# EAGLE design pwdproto (EAGLE 5.10)
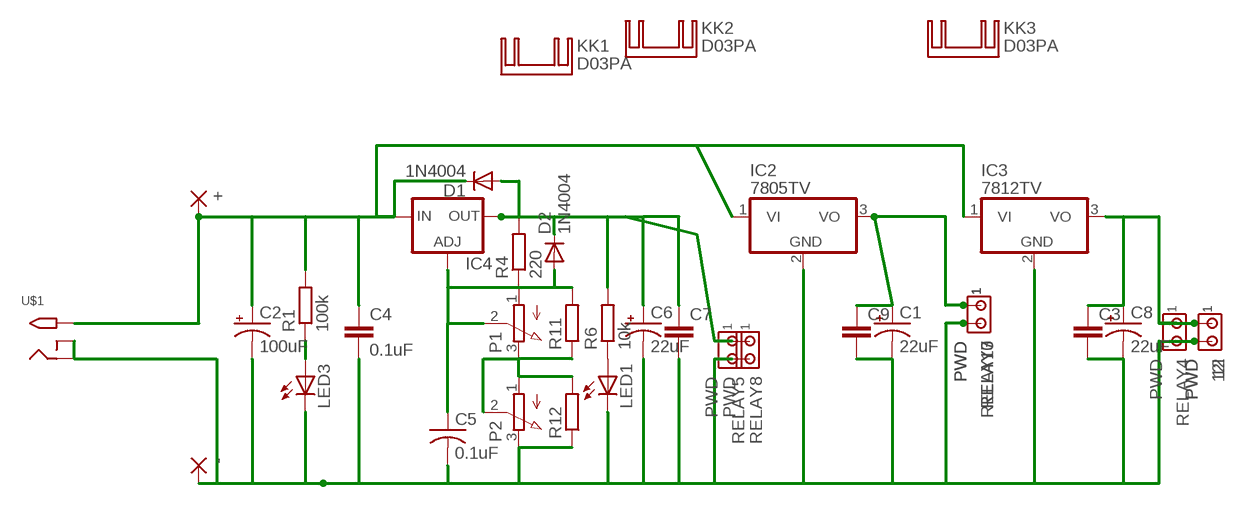
[diagram p0: schematic, sheet 1]

## Parts
12  PWD  MTA02-100  [10X02MTA]
12I  PWD  MTA02-100  [10X02MTA]
+  2,54/0,8  [2,54/0,8]
-  2,54/0,8  [2,54/0,8]
C1  22uF  CPOL-USE5-6  [E5-6]
C2  100uF  CPOL-USE5-6  [E5-6]
C3  C5/2.5  [C5B2.5]
C4  0.1uF  C5/2.5  [C5B2.5]
C5  0.1uF  C-US075-032X103  [C075-032X103]
C6  22uF  CPOL-USE5-6  [E5-6]
C7  C5/2.5  [C5B2.5]
C8  22uF  CPOL-USE5-6  [E5-6]
C9  C5/2.5  [C5B2.5]
D1  1N4004  [DO41-10]
D2  1N4004  [DO41-10]
IC2  7805TV  [TO220V]
IC3  7812TV  [TO220V]
IC4  LM317TS  [317TS]
KK1  D03PA  [D03PA]
KK2  D03PA  [D03PA]
KK3  D03PA  [D03PA]
LED1  LED3MM  [LED3MM]
LED3  LED3MM  [LED3MM]
P1  3RP/1610N  [3RP/1610N]
P2  3RP/1610N  [3RP/1610N]
R1  100k  R-EU_0207/7  [0207/7]
R4  220  R-EU_0207/7  [0207/7]
R6  10k  R-EU_0207/7  [0207/7]
R11  R-EU_0207/7  [0207/7]
R12  R-EU_0207/7  [0207/7]
RELAY3  PWD  MTA02-100  [10X02MTA]
RELAY4  PWD  MTA02-100  [10X02MTA]
RELAY5  PWD  MTA02-100  [10X02MTA]
RELAY7  PWD  MTA02-100  [10X02MTA]
RELAY8  PWD  MTA02-100  [10X02MTA]
RELAY10  PWD  MTA02-100  [10X02MTA]
U$1  2.1MMJACKTHM  [PJ-102A]

## Nets
GND: 12.2 12I.2 -.1(P) C1.- C2.- C3.2 C4.2 C5.2 C6.- C7.2 C8.- C9.2 IC2.2(GND) IC3.2(GND) LED1.K(C) LED3.K(C) P2.3(E) R12.1 RELAY3.2 RELAY4.2 RELAY5.2 RELAY7.2 RELAY8.2 RELAY10.2 U$1.RING U$1.RING_SW
N$2: LED1.A R6.1
N$6: +.1(P) C2.+ C4.1 D1.C IC2.1(VI) IC3.1(VI) IC4.3(IN) R1.2 U$1.TIP
N$12: LED3.A R1.1
N$14: P1.3(E) P2.1(A) P2.2(S) R11.1 R12.2
N$17: 12.1 12I.1 C3.1 C8.+ IC3.3(VO) RELAY4.1
N$18: C1.+ C9.1 IC2.3(VO) RELAY3.1 RELAY7.1 RELAY10.1
N$19: C5.1 D2.A IC4.1(ADJ) P1.1(A) P1.2(S) R4.1 R11.2
N$20: C6.+ C7.1 D1.A D2.C IC4.2(OUT) R4.2 R6.2 RELAY5.1 RELAY8.1

## Library data of the parts
12 12I RELAY3-RELAY5 RELAY7 RELAY8 RELAY10 = con-amp:MTA02-100: AMP connector
+ - = wirepad:2,54/0,8: THROUGH-HOLE PAD
C1 C2 C6 C8 = rcl:CPOL-US: POLARIZED CAPACITOR, American symbol
C3 C4 C7 C9 = capacitor-wima:C: CAPACITOR naming: grid - package width
C5 = adafruit:C-US: CAPACITOR, American symbol
D1 D2 = adafruit:1N4004: DIODE General purpose 1N400x type rectifier (With bigger pads) http://www.ladyada.net/library/pcb/eaglelibrary.html
IC2 IC3 = linear:78*: Positive VOLTAGE REGULATOR Source: http://cache.national.com/ds/LM/LM78L05.pdf http://www.fairchildsemi.com/ds/LM/LM7805.pdf
IC4 = v-reg:LM317TS: VOLTAGE REGULATOR
KK1-KK3 = heatsink:D03PA: HEATSINK distributor Schukat
LED1 LED3 = adafruit:LED: LED OSRAM: - CHIPLED LG R971, LG N971, LY N971, LG Q971, LY Q971, LO R971, LY R971 LH N974, LH R974 LS Q976, LO Q976, LY Q976 LO Q996 - Hyper CHIPLED LW Q18S LB Q993, LB Q99A, LB R99A - SideLED LS A670, LO A670, LY A670, LG A670, LP A670 LB A673, LV A673, LT A673, LW A673 LH A674 LY A675 LS A676, LA A676, LO A676, LY A676, LW A676 LS A679, LY A679, LG A679 - Hyper Micro SIDELED® LS Y876, LA Y876, LO Y876, LY Y876 LT Y87S - SmartLED LW L88C, LW L88S LB L89C, LB L89S, LG L890 LS L89K, LO L89K, LY L89K LS L896, LA L896, LO L896, LY L896 - TOPLED LS T670, LO T670, LY T670, LG T670, LP T670 LSG T670, LSP T670, LSY T670, LOP T670, LYG T670 LG T671, LOG T671, LSG T671 LB T673, LV T673, LT T673, LW T673 LH T674 LS T676, LA T676, LO T676, LY T676, LB T676, LH T676, LSB T676, LW T676 LB T67C, LV T67C, LT T67C, LS T67K, LO T67K, LY T67K, LW E67C LS E67B, LA E67B, LO E67B, LY E67B, LB E67C, LV E67C, LT E67C LW T67C LS T679, LY T679, LG T679 LS T770, LO T770, LY T770, LG T770, LP T770 LB T773, LV T773, LT T773, LW T773 LH T774 LS E675, LA E675, LY E675, LS T675 LS T776, LA T776, LO T776, LY T776, LB T776 LHGB T686 LT T68C, LB T68C - Hyper Mini TOPLED® LB M676 - Mini TOPLED Santana® LG M470 LS M47K, LO M47K, LY M47K Source: http://www.osram.convergy.de/
P1 P2 = pot:3RP/1610N: 16mm Potentiometer one level Source: http://www.alphapotentiometers.net/html/16mm_pot_2.html
R1 R4 R6 R11 R12 = resistor:R-EU_: RESISTOR, European symbol
U$1 = adafruit:2.1MMJACK: 2.1mm x 5.5mm THM DC jack with internal switch. Digikey part #PJ-102A, 4UCON part #05537 2.1mm x 5.5mm SMT DC jack with internal switch. Digikey part #PJ-002A-SMT, 4UCON part #03267 By microbuilder.eu & adafruit.com

## Board
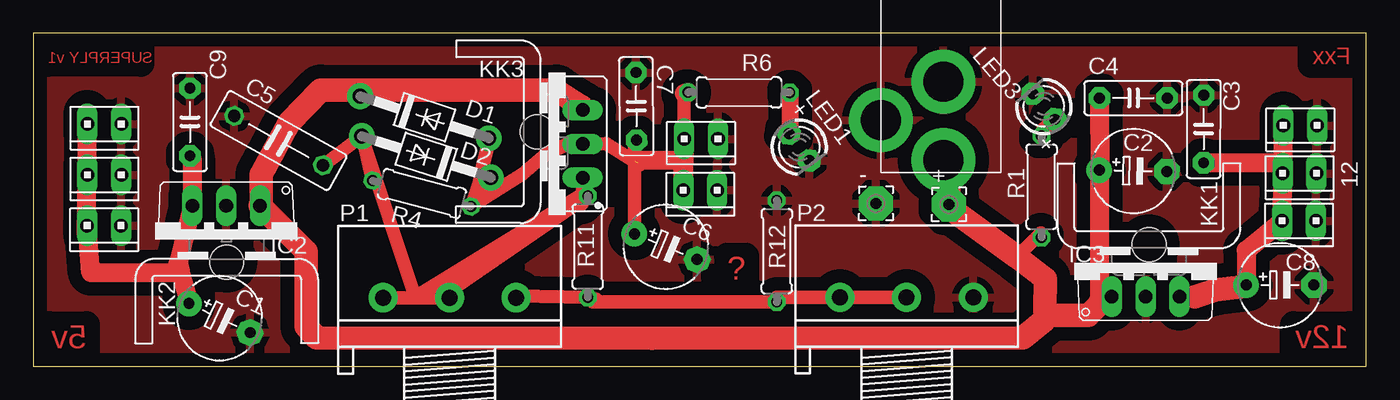
[diagram p1: board, top side]

Size 100 x 25 mm. Coordinates in mm from the lower left corner, seen from the top.
Outline: 100,0 100,25 0,25 0,0 100,0
Copper layers (1*16): Top 0.035mm / dielectric 1.5mm / Bottom 0.035mm
Design rules "default *": minimum track width 40mil, minimum drill 24mil, track to track 20mil, track to pad 35mil, pad to pad 20mil, via to via 20mil, smd to smd 8mil, copper to edge 40mil, drill to drill 8mil, minimum pad ring 10mil, minimum via ring 10mil, stop-mask expansion 8mil, vias tented up to drill 0mil, thermal gap 20mil

### Footprints (pad centres in the part's own frame; a part is rotated, then mirrored left to right if it is on the bottom)
10X02MTA = drill 1.016 long: 1 1.27,0; 2 -1.27,0
2,54/0,8 = drill 0.813 pad 2.54 octagon: 1 0,0
E5-6 = drill 0.813 pad 1.905 round: + -2.54,0 | drill 0.813 pad 1.905 octagon: - 2.54,0
C5B2.5 = drill 0.813 pad 1.6 octagon: 1 -2.54,0; 2 2.54,0
C075-032X103 = drill 0.914 octagon: 1 -3.81,0; 2 3.81,0
DO41-10 = drill 1.118 pad 1.93 round: A 5.08,0; C -5.08,0
TO220V = drill 1.016 long: 1 -2.54,-2.54; 2 0,-2.54; 3 2.54,-2.54
317TS = drill 1.016 long: 1 -2.54,-2.54; 2 0,-2.54; 3 2.54,-2.54
D03PA = hole 2.54: 0,-1.016
LED3MM = drill 0.813 pad 1.676 octagon: A -1.27,0; K 1.27,0
3RP/1610N = drill 1.2 pad 2.184 round: 1 -5,0; 2 0,0; 3 5,0
0207/7 = drill 0.813 octagon: 1 -3.81,0; 2 3.81,0
PJ-102A = drill 3 pad 4.8 round: RING 0.1,-3.39; RING_SW -4.6,-6.29; TIP 0.1,-9.29

### Placement (x,y rotation side)
12  95,14.48 180 top
12I  95.05,18.08 180 top
+  68.69,12.14 0 top
-  63.22,12.23 0 top
C1  13.97,3.62 334.6 top
C2  82.51,14.67 358.9 top
C3  87.81,17.81 89.9 top
C4  82.53,20.14 0 top
C5  18.4,16.94 150.9 top
C6  47.45,8.98 337.7 top
C7  45.24,19.52 90.5 top
C8  93.54,6.1 0 top
C9  11.75,18.34 90 top
D1  29.35,18.7 341.9 top
D2  29.48,15.72 162.2 top
IC2  14.47,9.52 180 top
IC3  83.45,7.76 0 top
IC4  38.67,16.7 90 top
KK1  83.71,10.14 0 top
KK2  14.5,6.8 180 top
KK3  36.8,17.6 90 top
LED1  57.46,16.46 306.8 top
LED3  75.82,19.5 131 top
P1  31.23,5.15 0 top
P2  65.52,5.16 0 top
R1  75.64,13.48 270 top
R4  29.15,12.97 345.2 top
R6  52.94,20.56 179.8 top
R11  41.6,8.98 90 top
R12  55.78,8.64 270 top
RELAY3  5.33,18.19 180 top
RELAY4  94.96,10.92 180 top
RELAY5  50.1,17.07 180 top
RELAY7  5.33,14.37 180 top
RELAY8  50.04,13.22 180 top
RELAY10  5.31,10.56 180 top
U$1  68.18,24.76 0 top

### Tracks (layer width: path | path; a pad name or v marks a point on that pad's centre or on a via)
GND
  pour Top (isolate 1.016): 100,25 -0.02,25 0,0 100,0
N$2
  Top 1.016: 56.77,17.45 LED1.A
  Top 1.27: R6.1 56.77,17.45
N$6
  Top 1.016: 46.4,2.1 46.81,1.84 | 41.14,19.51 IC4.3 | D1.C 21.96,20.96 21.56,20.74 | R1.2 75.58,10.02 73.78,8.22
  Top 1.422: C4.1 80.01,14.65 | C2.+ 79.97,4.72 IC3.1
  Top 1.778: 80.01,14.65 C2.+ | U$1.TIP 68.65,15.1 +.1 | +.1 68.7,15.04 | 75.91,4.27 75.87,3.46 74.25,2.12 46.4,2.1 21.24,2.15 20.45,2.99 20.45,8.62 IC2.1 17.08,12.13 17.09,14.4 19.21,18.31 21.56,20.74 39.22,20.75 41.14,19.51 | 79.97,4.72 80.59,5.26 79.16,3.83 76.06,3.83 75.91,4.27 | +.1 68.42,12.1 73.78,8.22 74.09,7.99 75.92,6.57 75.91,4.27
N$12
  Top 1.016: R1.1 75.79,17.81 75.75,17.76 LED3.A
N$14
  Top 1.016: P2.2 P2.1 55.74,5.17 R12.2 41.94,4.83 42.25,5.01 R11.1 36.19,5.27 P1.3
N$17
  Top 1.422: 87.13,5.21 IC3.3 | C8.+ 91,8.71 RELAY4.1 12.1 93.77,15.4 | 93.77,15.4 93.77,18.06 12I.1 | C3.1 92.96,15.27 93.77,15.4
  Top 1.778: 87.13,5.21 88.7,5.72 90.59,5.96 C8.+
N$18
  Top 1.016: RELAY7.1 4.08,10.25
  Top 1.422: RELAY3.1 RELAY7.1 3.98,9.85 RELAY10.1 4.32,7.01 10.97,7.01 11.03,7.08 | C9.1 11.91,15.64 IC2.3 10.86,7.74 11.03,7.08 | 11.03,7.08 C1.+
N$19
  Top 1.016: P1.2 P1.1 30.54,5.17 R11.2 41.15,12.88 | 41.15,12.88 28.63,5.19 D2.A | D2.A 24.8,16.96 R4.1 | D2.A 23.16,16.17 C5.1 | IC4.1 41.16,12.17 41.15,12.88
N$20  (1 unrouted)
  Top 1.016: 48.83,20.5 RELAY5.1 | 33.65,14.7 D2.C | 33.65,14.7 34.14,13.34 33.46,13.89 R4.2 36.7,14.43 38.29,15.79 39.96,16.63 40.36,16.51 40.82,16.85 IC4.2 42.96,16.72 45.12,15.37 | 45.12,15.37 C6.+ | 45.12,15.37 45.14,15.36 | D1.A 34.19,16.9 33.65,14.7 | 45.12,15.37 45.12,17.26 C7.1
  Top 1.422: R6.2 48.83,20.5 | 45.36,15.27 45.54,15.45 48.71,15.43 RELAY8.1 48.82,16.93 RELAY5.1

### Text on the board
Top: SUPERPLY v1 | Fxx | ? | 5v | 12v